# Altium schematic sheet 10. SOC SERDES0 IF.SchDoc: SERDES INTERFACE-1
size 513 x 386 mm; Project: PROC154E2(001)_SK_AM69; Issue: 1.0; RevCode: E3; Page Create Date: March  8, 1995; Variant Name: Core Design; Schematic Page Number: 10; Page Number: 10; Page Size: C; Comment: MISTRAL_TITLEBLK_CSIZE_1; Page Count: 62; Schematic Page Count: 62; Name: PROC154E2 001 SK AM69; DsnPath: C:\Users\danie\Downloads\sprr466c\PROC154E3_RP\PROC154E3_SCH.DSN; SchematicName: SCHEMATIC1; PageName: 10. SOC SERDES0 IF; PageSize: C; TopSchematic: True
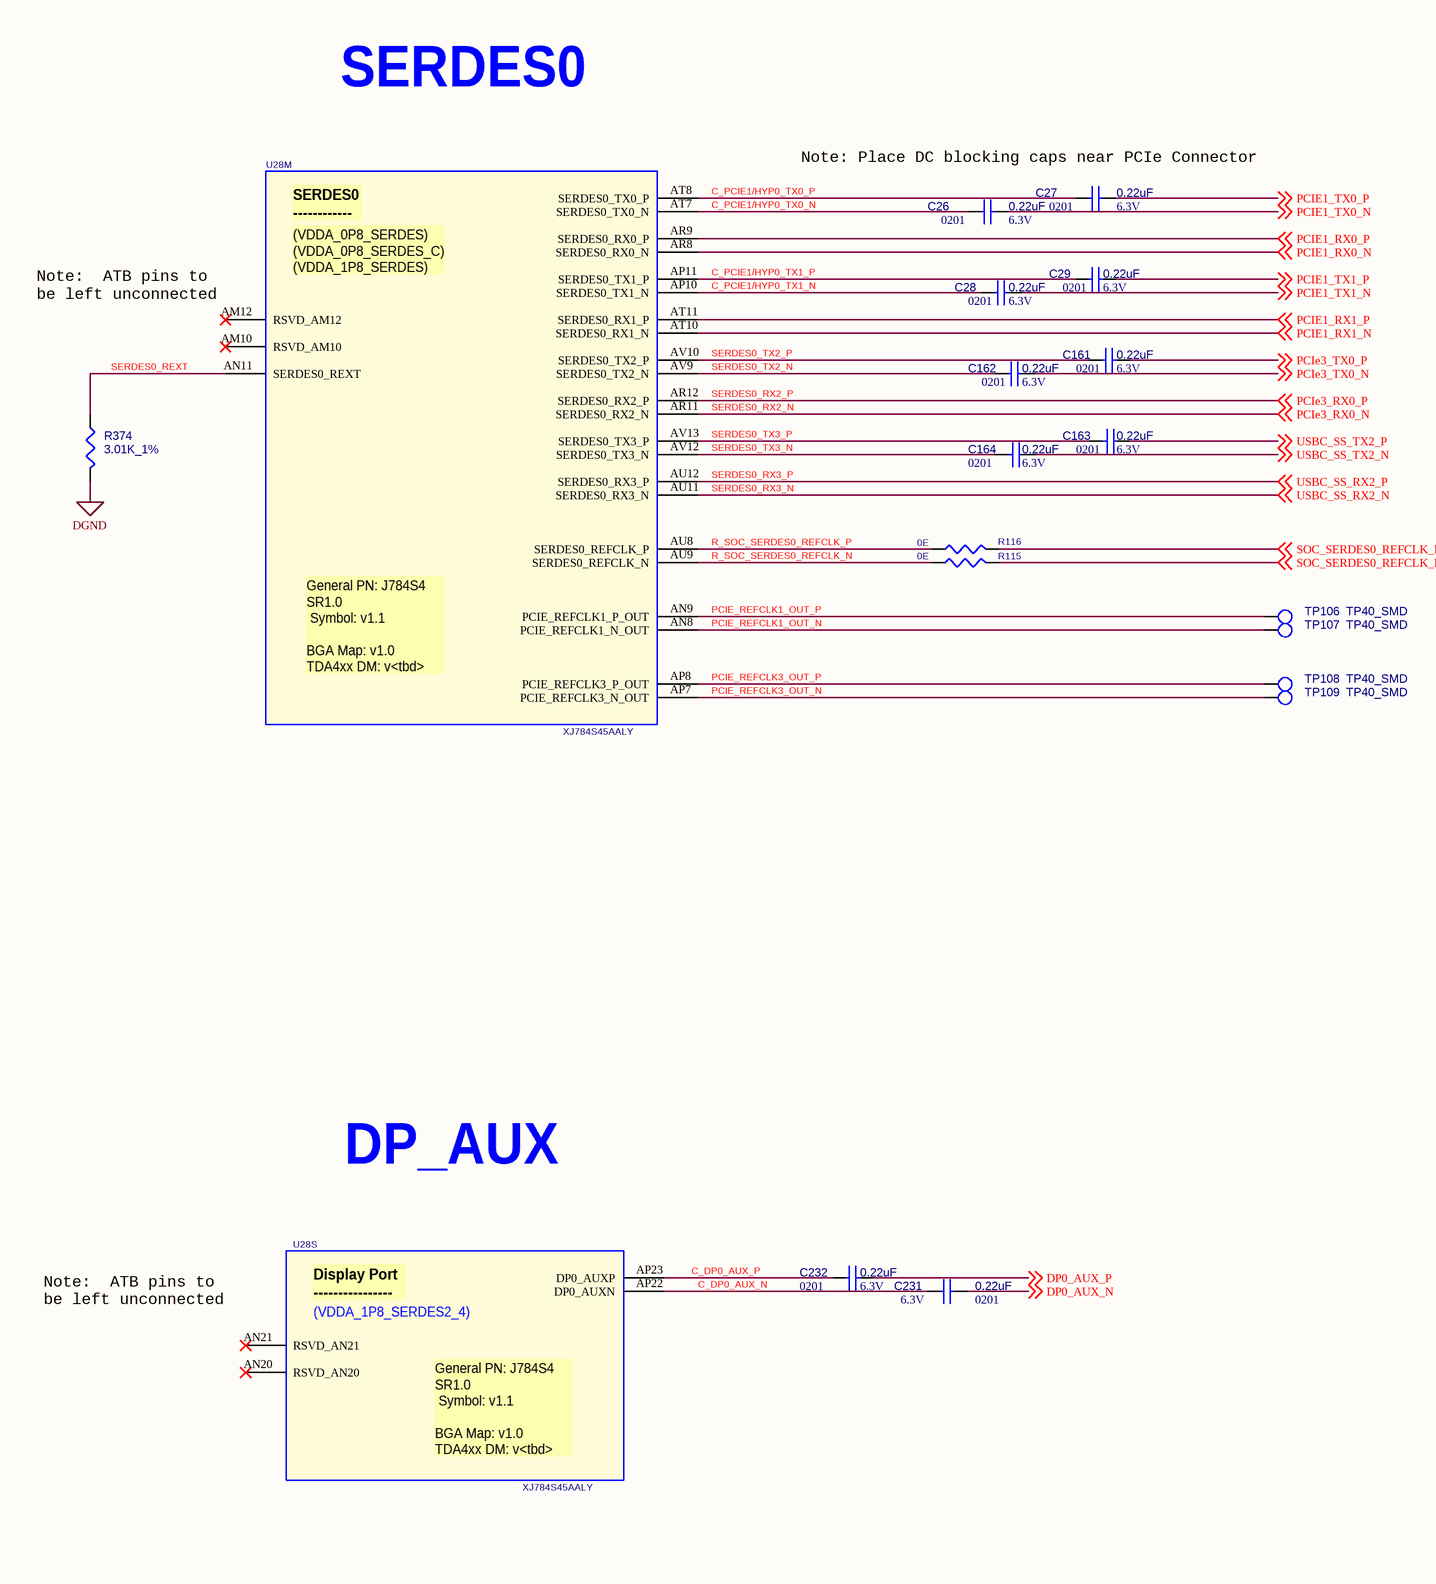
[diagram p0: 10. SOC SERDES0 IF.SchDoc, left]
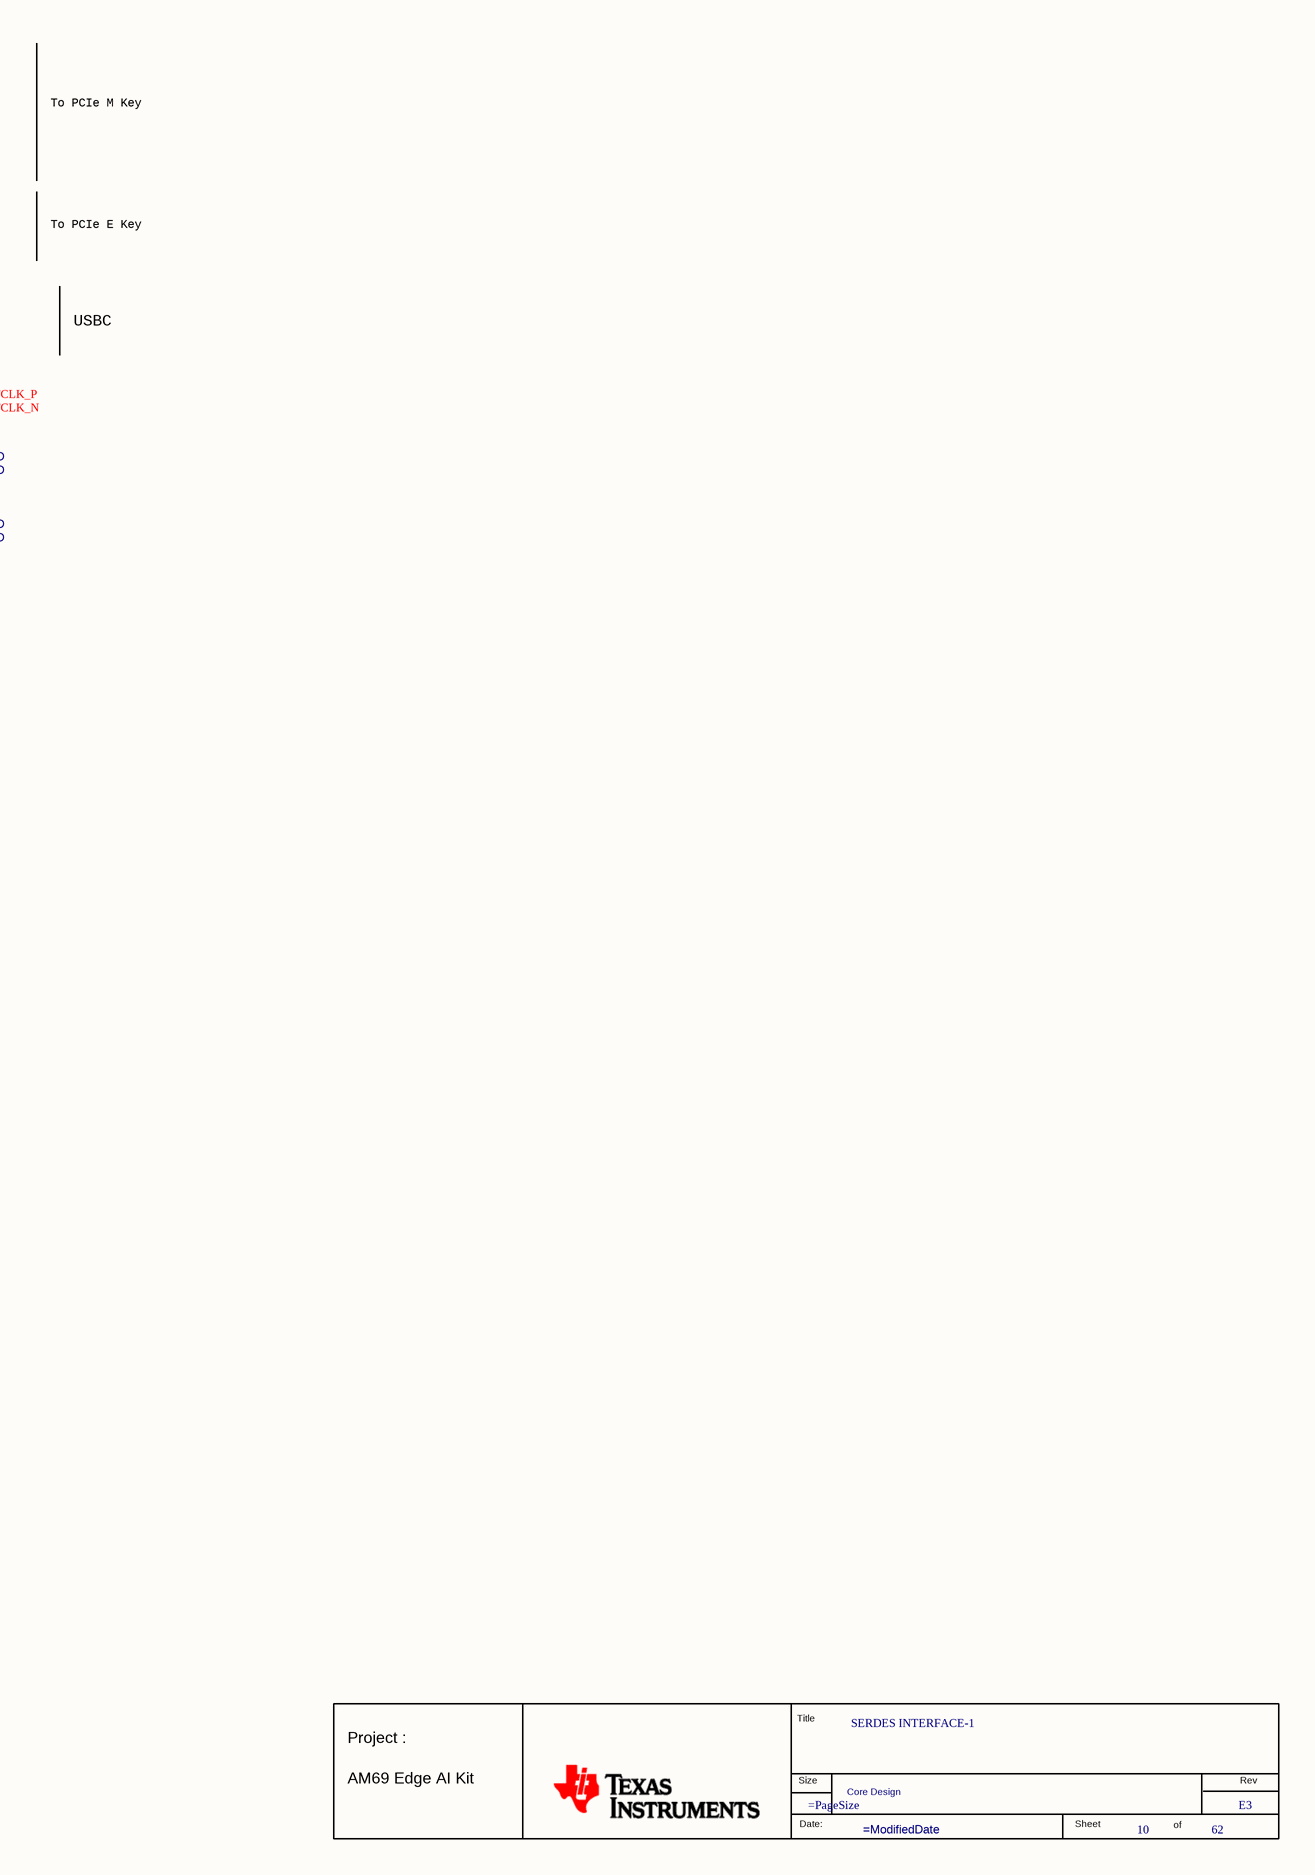
[diagram p1: 10. SOC SERDES0 IF.SchDoc, right]

## Parts
*  RevCode: E3  Title: SERDES INTERFACE-1  Page Number: 10  Page Count: 62  Variant Name: Core Design  (hidden comment: MISTRAL_TITLEBLK_CSIZE_1)  (graphical)
C26  0.22uF  Package: 0201  Voltage: 6.3V  [CAP0201_0-5]
C27  0.22uF  Voltage: 6.3V  Package: 0201  [CAP0201_0-5]
C28  0.22uF  Package: 0201  Voltage: 6.3V  [CAP0201_0-5]
C29  0.22uF  Package: 0201  Voltage: 6.3V  [CAP0201_0-5]
C161  0.22uF  Voltage: 6.3V  Package: 0201  [CAP0201_0-5]
C162  0.22uF  Voltage: 6.3V  Package: 0201  [CAP0201_0-5]
C163  0.22uF  Package: 0201  Voltage: 6.3V  [CAP0201_0-5]
C164  0.22uF  Voltage: 6.3V  Package: 0201  [CAP0201_0-5]
C231  0.22uF  Voltage: 6.3V  Package: 0201  [CAP0201_0-5]
C232  0.22uF  Package: 0201  Voltage: 6.3V  [CAP0201_0-5]
R115  0E  [RES0201_0-5]
R116  0E  [RES0201_0-5]
R374  3.01K_1%  [RES0201_0-5]
TP106  TP40_SMD  [TP40_SMD]
TP107  TP40_SMD  [TP40_SMD]
TP108  TP40_SMD  [TP40_SMD]
TP109  TP40_SMD  [TP40_SMD]
U28  XJ784S45AALY  [BGA1414_31-49_1230X1230_2-7]  (parts M,S of 26)

## Nets
DGND: R374.2
C_DP0_AUX_N: C231.1 U28.AP22(DP0_AUXN)
C_DP0_AUX_P: C232.1 U28.AP23(DP0_AUXP)
C_PCIE1/HYP0_TX0_N: C26.1 U28.AT7(SERDES0_TX0_N)
C_PCIE1/HYP0_TX0_P: C27.1 U28.AT8(SERDES0_TX0_P)
C_PCIE1/HYP0_TX1_N: C28.1 U28.AP10(SERDES0_TX1_N)
C_PCIE1/HYP0_TX1_P: C29.1 U28.AP11(SERDES0_TX1_P)
DP0_AUX_N: C231.2 ; off-sheet DP0_AUX_N
DP0_AUX_P: C232.2 ; off-sheet DP0_AUX_P
PCIE1_RX0_N: U28.AR8(SERDES0_RX0_N) ; off-sheet PCIE1_RX0_N
PCIE1_RX0_P: U28.AR9(SERDES0_RX0_P) ; off-sheet PCIE1_RX0_P
PCIE1_RX1_N: U28.AT10(SERDES0_RX1_N) ; off-sheet PCIE1_RX1_N
PCIE1_RX1_P: U28.AT11(SERDES0_RX1_P) ; off-sheet PCIE1_RX1_P
PCIE1_TX0_N: C26.2 ; off-sheet PCIE1_TX0_N
PCIE1_TX0_P: C27.2 ; off-sheet PCIE1_TX0_P
PCIE1_TX1_N: C28.2 ; off-sheet PCIE1_TX1_N
PCIE1_TX1_P: C29.2 ; off-sheet PCIE1_TX1_P
PCIe3_TX0_N: C162.2 ; off-sheet PCIe3_TX0_N
PCIe3_TX0_P: C161.2 ; off-sheet PCIe3_TX0_P
PCIE_REFCLK1_OUT_N: TP107.1(TP) U28.AN8(PCIE_REFCLK1_N_OUT)
PCIE_REFCLK1_OUT_P: TP106.1(TP) U28.AN9(PCIE_REFCLK1_P_OUT)
PCIE_REFCLK3_OUT_N: TP109.1(TP) U28.AP7(PCIE_REFCLK3_N_OUT)
PCIE_REFCLK3_OUT_P: TP108.1(TP) U28.AP8(PCIE_REFCLK3_P_OUT)
R_SOC_SERDES0_REFCLK_N: R115.2 U28.AU9(SERDES0_REFCLK_N)
R_SOC_SERDES0_REFCLK_P: R116.2 U28.AU8(SERDES0_REFCLK_P)
SERDES0_REXT: R374.1 U28.AN11(SERDES0_REXT)
SERDES0_RX2_N: U28.AR11(SERDES0_RX2_N) ; off-sheet PCIe3_RX0_N  [also labelled PCIe3_RX0_N]
SERDES0_RX2_P: U28.AR12(SERDES0_RX2_P) ; off-sheet PCIe3_RX0_P  [also labelled PCIe3_RX0_P]
SERDES0_RX3_N: U28.AU11(SERDES0_RX3_N) ; off-sheet USBC_SS_RX2_N  [also labelled USBC_SS_RX2_N]
SERDES0_RX3_P: U28.AU12(SERDES0_RX3_P) ; off-sheet USBC_SS_RX2_P  [also labelled USBC_SS_RX2_P]
SERDES0_TX2_N: C162.1 U28.AV9(SERDES0_TX2_N)
SERDES0_TX2_P: C161.1 U28.AV10(SERDES0_TX2_P)
SERDES0_TX3_N: C164.2 U28.AV12(SERDES0_TX3_N)
SERDES0_TX3_P: C163.2 U28.AV13(SERDES0_TX3_P)
SOC_SERDES0_REFCLK_N: R115.1 ; off-sheet SOC_SERDES0_REFCLK_N
SOC_SERDES0_REFCLK_P: R116.1 ; off-sheet SOC_SERDES0_REFCLK_P
USBC_SS_TX2_N: C164.1 ; off-sheet USBC_SS_TX2_N
USBC_SS_TX2_P: C163.1 ; off-sheet USBC_SS_TX2_P

Not connected (* = marked no-connect by the designer): U28 AM10(RSVD_AM10)* AM12(RSVD_AM12)* AN20(RSVD_AN20)* AN21(RSVD_AN21)*

## Notes on the sheet
- SERDES0
- Note: Place DC blocking caps near PCIe Connector
- (near U28) Note:  ATB pins to
  be left unconnected
- To PCIe M Key
- To PCIe E Key
- USBC
- DP_AUX
- (in symbol J7AHPSoC-EVM_BGA1414, part M) SERDES0 / ------------; (VDDA_0P8_SERDES) / (VDDA_0P8_SERDES_C) / (VDDA_1P8_SERDES); General PN: J784S4 / SR1.0 / Symbol: v1.1 / BGA Map: v1.0 / TDA4xx DM: v<tbd>
- (in symbol J7AHPSoC-EVM_BGA1414, part S) Display Port / ----------------; (VDDA_1P8_SERDES2_4); General PN: J784S4 / SR1.0 / Symbol: v1.1 / BGA Map: v1.0 / TDA4xx DM: v<tbd>
- (in symbol MISTRAL_TITLEBLK_CSIZE_1) Title; Project :; Size; Rev; AM69 Edge AI Kit; Date:; Sheet; of

## Library data of the parts
* = MISTRAL_TITLEBLK_CSIZE_1: Issue: 1.0; Project: PROC154E2(001)_SK_AM69; Name: PROC154E2 001 SK AM69; Page Create Date: March  8, 1995; Page Size: =PageSize; Page Modify Date: =ModifiedDate; Schematic Page Count: 62; Schematic Page Number: 10
C26 = CAP_Dup1: CAP CERAMIC 0.22uF 6.3V 10% X6S AUTO 0201; Part Reference: C26; Manufacturer: MURATA; Part_type: CAPACITORS\CERAMIC; Mfr_part_number: GRT033C80J224KE01D; Mistral Part No: 120019020011-R; Custom_Duty: 15%; Customs_HS_Code: 85322990; Wattage: NA; Project: TI_J7ES_EVM_SOM; SIGNAL_MODEL: CAP_CAP0201_0-5_0.22UF_0.22uF; Value: 0.22uF; Chkd/date: MANIRAJA/220219; Crtd /date: ALVY/220219; Datasheet: Y:\MIS_DATABASE\DATASHEETS\CAPACITORS\MURATA-GCM-SER.PDF; Temperature: -55°C+105°C; Weight: 0.17mg; Height: 0.33MM; Library Ref: CAP; Distributor_part_number: 490-12230-1-ND; Distributor_name: DIGIKEY; Tolerance: 10%; Mfr_name: MURATA; MECHANICAL 3D STEP FILE: CAP0201_0-5; Footprint Ref: CAP0201_0-5; Library Path: Y:\MIS_DATABASE\Library\ALTIUM_TOOL\SCHEMATICS_PARTS\MS_DISCRETE_Library.schlib; Footprint Path: Y:\MIS_DATABASE\Library\ALTIUM_TOOL\PCB_FOOTPRINTS\Altium_Footprint_Lib.PcbLib; PCB Footprint: CAP0201_0-5
C27 = CAP_Dup1: CAP CERAMIC 0.22uF 6.3V 10% X6S AUTO 0201; Part Reference: C27; Manufacturer: MURATA; Mistral Part No: 120019020011-R; Mfr_part_number: GRT033C80J224KE01D; Part_type: CAPACITORS\CERAMIC; Project: TI_J7ES_EVM_SOM; Wattage: NA; Customs_HS_Code: 85322990; Custom_Duty: 15%; SIGNAL_MODEL: CAP_CAP0201_0-5_0.22UF_0.22uF; Value: 0.22uF; MECHANICAL 3D STEP FILE: CAP0201_0-5; Mfr_name: MURATA; Tolerance: 10%; Distributor_name: DIGIKEY; Distributor_part_number: 490-12230-1-ND; Library Ref: CAP; Height: 0.33MM; Weight: 0.17mg; Temperature: -55°C+105°C; Datasheet: Y:\MIS_DATABASE\DATASHEETS\CAPACITORS\MURATA-GCM-SER.PDF; Crtd /date: ALVY/220219; Chkd/date: MANIRAJA/220219; Footprint Ref: CAP0201_0-5; Library Path: Y:\MIS_DATABASE\Library\ALTIUM_TOOL\SCHEMATICS_PARTS\MS_DISCRETE_Library.schlib; Footprint Path: Y:\MIS_DATABASE\Library\ALTIUM_TOOL\PCB_FOOTPRINTS\Altium_Footprint_Lib.PcbLib; PCB Footprint: CAP0201_0-5
C28 = CAP_Dup1: CAP CERAMIC 0.22uF 6.3V 10% X6S AUTO 0201; Part Reference: C28; Manufacturer: MURATA; Part_type: CAPACITORS\CERAMIC; Mfr_part_number: GRT033C80J224KE01D; Mistral Part No: 120019020011-R; Custom_Duty: 15%; Customs_HS_Code: 85322990; Wattage: NA; Project: TI_J7ES_EVM_SOM; SIGNAL_MODEL: CAP_CAP0201_0-5_0.22UF_0.22uF; Value: 0.22uF; Chkd/date: MANIRAJA/220219; Crtd /date: ALVY/220219; Datasheet: Y:\MIS_DATABASE\DATASHEETS\CAPACITORS\MURATA-GCM-SER.PDF; Temperature: -55°C+105°C; Weight: 0.17mg; Height: 0.33MM; Library Ref: CAP; Distributor_part_number: 490-12230-1-ND; Distributor_name: DIGIKEY; Tolerance: 10%; Mfr_name: MURATA; MECHANICAL 3D STEP FILE: CAP0201_0-5; Footprint Ref: CAP0201_0-5; Library Path: Y:\MIS_DATABASE\Library\ALTIUM_TOOL\SCHEMATICS_PARTS\MS_DISCRETE_Library.schlib; Footprint Path: Y:\MIS_DATABASE\Library\ALTIUM_TOOL\PCB_FOOTPRINTS\Altium_Footprint_Lib.PcbLib; PCB Footprint: CAP0201_0-5
C29 = CAP_Dup1: CAP CERAMIC 0.22uF 6.3V 10% X6S AUTO 0201; Part Reference: C29; Manufacturer: MURATA; Part_type: CAPACITORS\CERAMIC; Mfr_part_number: GRT033C80J224KE01D; Mistral Part No: 120019020011-R; Custom_Duty: 15%; Customs_HS_Code: 85322990; Wattage: NA; Project: TI_J7ES_EVM_SOM; SIGNAL_MODEL: CAP_CAP0201_0-5_0.22UF_0.22uF; Value: 0.22uF; Footprint Path: Y:\MIS_DATABASE\Library\ALTIUM_TOOL\PCB_FOOTPRINTS\Altium_Footprint_Lib.PcbLib; Library Path: Y:\MIS_DATABASE\Library\ALTIUM_TOOL\SCHEMATICS_PARTS\MS_DISCRETE_Library.schlib; Footprint Ref: CAP0201_0-5; Chkd/date: MANIRAJA/220219; Crtd /date: ALVY/220219; Datasheet: Y:\MIS_DATABASE\DATASHEETS\CAPACITORS\MURATA-GCM-SER.PDF; Temperature: -55°C+105°C; Weight: 0.17mg; Height: 0.33MM; Library Ref: CAP; Distributor_part_number: 490-12230-1-ND; Distributor_name: DIGIKEY; Tolerance: 10%; Mfr_name: MURATA; MECHANICAL 3D STEP FILE: CAP0201_0-5; PCB Footprint: CAP0201_0-5
C161 = CAP_Dup1: CAP CERAMIC 0.22uF 6.3V 10% X6S AUTO 0201; Part Reference: C161; Manufacturer: MURATA; Mistral Part No: 120019020011-R; Mfr_part_number: GRT033C80J224KE01D; Part_type: CAPACITORS\CERAMIC; Project: TI_J7ES_EVM_SOM; Wattage: NA; Customs_HS_Code: 85322990; Custom_Duty: 15%; Value: 0.22uF; Footprint Path: Y:\MIS_DATABASE\Library\ALTIUM_TOOL\PCB_FOOTPRINTS\Altium_Footprint_Lib.PcbLib; Library Path: Y:\MIS_DATABASE\Library\ALTIUM_TOOL\SCHEMATICS_PARTS\MS_DISCRETE_Library.schlib; Footprint Ref: CAP0201_0-5; MECHANICAL 3D STEP FILE: CAP0201_0-5; Mfr_name: MURATA; Tolerance: 10%; Distributor_name: DIGIKEY; Distributor_part_number: 490-12230-1-ND; Library Ref: CAP; Height: 0.33MM; Weight: 0.17mg; Temperature: -55°C+105°C; Datasheet: Y:\MIS_DATABASE\DATASHEETS\CAPACITORS\MURATA-GCM-SER.PDF; Crtd /date: ALVY/220219; Chkd/date: MANIRAJA/220219; PCB Footprint: CAP0201_0-5
C162 = CAP_Dup1: CAP CERAMIC 0.22uF 6.3V 10% X6S AUTO 0201; Part Reference: C162; Manufacturer: MURATA; Mistral Part No: 120019020011-R; Mfr_part_number: GRT033C80J224KE01D; Part_type: CAPACITORS\CERAMIC; Project: TI_J7ES_EVM_SOM; Wattage: NA; Customs_HS_Code: 85322990; Custom_Duty: 15%; Value: 0.22uF; Footprint Path: Y:\MIS_DATABASE\Library\ALTIUM_TOOL\PCB_FOOTPRINTS\Altium_Footprint_Lib.PcbLib; Library Path: Y:\MIS_DATABASE\Library\ALTIUM_TOOL\SCHEMATICS_PARTS\MS_DISCRETE_Library.schlib; Footprint Ref: CAP0201_0-5; MECHANICAL 3D STEP FILE: CAP0201_0-5; Mfr_name: MURATA; Tolerance: 10%; Distributor_name: DIGIKEY; Distributor_part_number: 490-12230-1-ND; Library Ref: CAP; Height: 0.33MM; Weight: 0.17mg; Temperature: -55°C+105°C; Datasheet: Y:\MIS_DATABASE\DATASHEETS\CAPACITORS\MURATA-GCM-SER.PDF; Crtd /date: ALVY/220219; Chkd/date: MANIRAJA/220219; PCB Footprint: CAP0201_0-5
C163 = CAP_Dup1: CAP CERAMIC 0.22uF 6.3V 10% X6S AUTO 0201; Part Reference: C163; Part_type: CAPACITORS\CERAMIC; Mfr_part_number: GRT033C80J224KE01D; Mfr_name: MURATA; Mistral Part No: 120019020011-R; Custom_Duty: 15%; Customs_HS_Code: 85322990; Wattage: NA; Project: TI_J7ES_EVM_SOM; Value: 0.22uF; Chkd/date: MANIRAJA/220219; Crtd /date: ALVY/220219; Datasheet: Y:\MIS_DATABASE\DATASHEETS\CAPACITORS\MURATA-GCM-SER.PDF; Temperature: -55°C+105°C; Weight: 0.17mg; Height: 0.33MM; Library Ref: CAP; Distributor_part_number: 490-12230-1-ND; Distributor_name: DIGIKEY; Tolerance: 10%; MECHANICAL 3D STEP FILE: CAP0201_0-5; Footprint Ref: CAP0201_0-5; Library Path: Y:\MIS_DATABASE\Library\ALTIUM_TOOL\SCHEMATICS_PARTS\MS_DISCRETE_Library.schlib; Footprint Path: Y:\MIS_DATABASE\Library\ALTIUM_TOOL\PCB_FOOTPRINTS\Altium_Footprint_Lib.PcbLib; Manufacturer: MURATA; PCB Footprint: CAP0201_0-5
C164 = CAP_Dup1: CAP CERAMIC 0.22uF 6.3V 10% X6S AUTO 0201; Part Reference: C164; Mistral Part No: 120019020011-R; Mfr_name: MURATA; Mfr_part_number: GRT033C80J224KE01D; Part_type: CAPACITORS\CERAMIC; Project: TI_J7ES_EVM_SOM; Wattage: NA; Customs_HS_Code: 85322990; Custom_Duty: 15%; Value: 0.22uF; Footprint Path: Y:\MIS_DATABASE\Library\ALTIUM_TOOL\PCB_FOOTPRINTS\Altium_Footprint_Lib.PcbLib; Library Path: Y:\MIS_DATABASE\Library\ALTIUM_TOOL\SCHEMATICS_PARTS\MS_DISCRETE_Library.schlib; Footprint Ref: CAP0201_0-5; MECHANICAL 3D STEP FILE: CAP0201_0-5; Tolerance: 10%; Distributor_name: DIGIKEY; Distributor_part_number: 490-12230-1-ND; Library Ref: CAP; Height: 0.33MM; Weight: 0.17mg; Temperature: -55°C+105°C; Datasheet: Y:\MIS_DATABASE\DATASHEETS\CAPACITORS\MURATA-GCM-SER.PDF; Crtd /date: ALVY/220219; Chkd/date: MANIRAJA/220219; Manufacturer: MURATA; PCB Footprint: CAP0201_0-5
C231 = CAP_Dup1: CAP CERAMIC 0.22uF 6.3V 10% X6S AUTO 0201; Part Reference: C231; Mistral Part No: 120019020011-R; Mfr_name: MURATA; Mfr_part_number: GRT033C80J224KE01D; Part_type: CAPACITORS\CERAMIC; Project: TI_J7ES_EVM_SOM; Wattage: NA; Customs_HS_Code: 85322990; Custom_Duty: 15%; SIGNAL_MODEL: CAP_CAP0201_0-5_0.22UF_0.22uF; Value: 0.22uF; PCB Footprint: CAP0201_0-5; Footprint Ref: CAP0201_0-5; Tolerance: 10%; Distributor_name: DIGIKEY; Distributor_part_number: 490-12230-1-ND; Library Ref: CAP; Height: 0.33MM; Weight: 0.17mg; Temperature: -55°C+105°C; Datasheet: Y:\MIS_DATABASE\DATASHEETS\CAPACITORS\MURATA-GCM-SER.PDF; Crtd /date: ALVY/220219; Chkd/date: MANIRAJA/220219; MECHANICAL 3D STEP FILE: CAP0201_0-5; Library Path: Y:\MIS_DATABASE\Library\ALTIUM_TOOL\SCHEMATICS_PARTS\MS_DISCRETE_Library.schlib; Footprint Path: Y:\MIS_DATABASE\Library\ALTIUM_TOOL\PCB_FOOTPRINTS\Altium_Footprint_Lib.PcbLib; Manufacturer: MURATA
C232 = CAP_Dup1: CAP CERAMIC 0.22uF 6.3V 10% X6S AUTO 0201; Part Reference: C232; Part_type: CAPACITORS\CERAMIC; Mfr_part_number: GRT033C80J224KE01D; Mfr_name: MURATA; Mistral Part No: 120019020011-R; Custom_Duty: 15%; Customs_HS_Code: 85322990; Wattage: NA; Project: TI_J7ES_EVM_SOM; SIGNAL_MODEL: CAP_CAP0201_0-5_0.22UF_0.22uF; Value: 0.22uF; PCB Footprint: CAP0201_0-5; Footprint Path: Y:\MIS_DATABASE\Library\ALTIUM_TOOL\PCB_FOOTPRINTS\Altium_Footprint_Lib.PcbLib; Library Path: Y:\MIS_DATABASE\Library\ALTIUM_TOOL\SCHEMATICS_PARTS\MS_DISCRETE_Library.schlib; MECHANICAL 3D STEP FILE: CAP0201_0-5; Chkd/date: MANIRAJA/220219; Crtd /date: ALVY/220219; Datasheet: Y:\MIS_DATABASE\DATASHEETS\CAPACITORS\MURATA-GCM-SER.PDF; Temperature: -55°C+105°C; Weight: 0.17mg; Height: 0.33MM; Library Ref: CAP; Distributor_part_number: 490-12230-1-ND; Distributor_name: DIGIKEY; Tolerance: 10%; Footprint Ref: CAP0201_0-5; Manufacturer: MURATA
R115 = RESISTOR: RES 0E 1/20W 5% 0201; Part Reference: R115; Manufacturer: YAGEO AMERICA; Mistral Part No: 110010070067-R; Mfr_part_number: RC0201JR-070RL; Part_type: RESISTORS\FIXED; Project: PB_BUGBASE; Voltage: NA; Customs_HS_Code: 85332119; Custom_Duty: 15%; Value: 0E; Footprint Ref: RES0201_0-5; Mfr_name: YAGEO AMERICA; Tolerance: 5%; Wattage: 1/20W; Package: 0201; Distributor_name: DIGIKEY; Distributor_part_number: 311-0.0NCT-ND; Library Ref: RESISTOR; Height: 0.26MM; Weight: 0.17mg; Temperature: -55°C+125°C; Datasheet: Y:\MIS_DATABASE\DATASHEETS\RESISTORS\RCXXXXL-SER_MAR18.PDF; Crtd /date: MUDDU/120710; Chkd/date: NAVEED/301214; MECHANICAL 3D STEP FILE: RES0201_0-5; Library Path: Y:\MIS_DATABASE\Library\ALTIUM_TOOL\SCHEMATICS_PARTS\MS_DISCRETE_Library.schlib; Footprint Path: Y:\MIS_DATABASE\Library\ALTIUM_TOOL\PCB_FOOTPRINTS\Altium_Footprint_Lib.PcbLib; PCB Footprint: RES0201_0-5
R116 = RESISTOR: RES 0E 1/20W 5% 0201; Part Reference: R116; Manufacturer: YAGEO AMERICA; Part_type: RESISTORS\FIXED; Mfr_part_number: RC0201JR-070RL; Mistral Part No: 110010070067-R; Custom_Duty: 15%; Customs_HS_Code: 85332119; Voltage: NA; Project: PB_BUGBASE; Value: 0E; Footprint Path: Y:\MIS_DATABASE\Library\ALTIUM_TOOL\PCB_FOOTPRINTS\Altium_Footprint_Lib.PcbLib; Library Path: Y:\MIS_DATABASE\Library\ALTIUM_TOOL\SCHEMATICS_PARTS\MS_DISCRETE_Library.schlib; MECHANICAL 3D STEP FILE: RES0201_0-5; Chkd/date: NAVEED/301214; Crtd /date: MUDDU/120710; Datasheet: Y:\MIS_DATABASE\DATASHEETS\RESISTORS\RCXXXXL-SER_MAR18.PDF; Temperature: -55°C+125°C; Weight: 0.17mg; Height: 0.26MM; Library Ref: RESISTOR; Distributor_part_number: 311-0.0NCT-ND; Distributor_name: DIGIKEY; Package: 0201; Wattage: 1/20W; Tolerance: 5%; Mfr_name: YAGEO AMERICA; Footprint Ref: RES0201_0-5; PCB Footprint: RES0201_0-5
R374 = RESISTOR_Dup2: RES 3.01K 1/20W 1% 0201; Part Reference: R374; Manufacturer: PANASONIC-ECG; Part_type: RESISTORS\FIXED; Mfr_part_number: ERJ-1GNF3011C; Mistral Part No: 110015080044-R; Custom_Duty: 15%; Customs_HS_Code: 85332119; Voltage: NA; Project: J7ES_SOM_DUAL-LEO_PMIC; Value: 3.01K_1%; PCB Footprint: RES0201_0-5; Chkd/date: MANIRAJA/160519; Crtd /date: ALVY/160519; Datasheet: Y:\MIS_DATABASE\DATASHEETS\RESISTORS\PAN-ERJSER_NOV17.PDF; Temperature: -55°C+125°C; Weight: 0.15mg; Height: 0.26MM; Library Ref: RESISTOR; Distributor_part_number: P122916CT-ND; Distributor_name: DIGIKEY; Package: 0201; Wattage: 1/20W; Tolerance: 1%; Mfr_name: PANASONIC-ECG; Footprint Ref: RES0201_0-5; MECHANICAL 3D STEP FILE: RES0201_0-5; Library Path: Y:\MIS_DATABASE\Library\ALTIUM_TOOL\SCHEMATICS_PARTS\MS_DISCRETE_Library.schlib; Footprint Path: Y:\MIS_DATABASE\Library\ALTIUM_TOOL\PCB_FOOTPRINTS\Altium_Footprint_Lib.PcbLib
TP106 = TESTPOINT_Dup1: TESTPOINT CIR 40 SMD; Part Reference: TP106; Mfr_name: LOCAL; Mistral Part No: 130009030933; MECHANICAL 3D STEP FILE: NA; Project: RAINIER-3; Value: TP40_SMD; PCB Footprint: TP40_SMD; Footprint Ref: TP40_SMD; Library Ref: TESTPOINT; Footprint Path: Y:\MIS_DATABASE\Library\ALTIUM_TOOL\PCB_FOOTPRINTS\Altium_Footprint_Lib.PcbLib; Library Path: Y:\MIS_DATABASE\Library\ALTIUM_TOOL\SCHEMATICS_PARTS\MS_DISCRETE_Library.schlib; Chkd/date: MAZHAR/190505; Crtd /date: MAZHAR/190505; Datasheet: NA; Temperature: NA; Weight: NA; Height: NA; Distributor_part_number: NA; Distributor_name: NA; Package: SMD; Wattage: NA; Voltage: NA; Tolerance: NA; Part_type: TESTPOINT; Mfr_part_number: TP40_SMD; RoHS: NA; Manufacturer: LOCAL
TP107 = TESTPOINT_Dup1: TESTPOINT CIR 40 SMD; Part Reference: TP107; Mfr_name: LOCAL; Mistral Part No: 130009030933; MECHANICAL 3D STEP FILE: NA; Project: RAINIER-3; Value: TP40_SMD; PCB Footprint: TP40_SMD; Footprint Ref: TP40_SMD; Library Ref: TESTPOINT; Footprint Path: Y:\MIS_DATABASE\Library\ALTIUM_TOOL\PCB_FOOTPRINTS\Altium_Footprint_Lib.PcbLib; Library Path: Y:\MIS_DATABASE\Library\ALTIUM_TOOL\SCHEMATICS_PARTS\MS_DISCRETE_Library.schlib; Chkd/date: MAZHAR/190505; Crtd /date: MAZHAR/190505; Datasheet: NA; Temperature: NA; Weight: NA; Height: NA; Distributor_part_number: NA; Distributor_name: NA; Package: SMD; Wattage: NA; Voltage: NA; Tolerance: NA; Part_type: TESTPOINT; Mfr_part_number: TP40_SMD; RoHS: NA; Manufacturer: LOCAL
TP108 = TESTPOINT_Dup1: TESTPOINT CIR 40 SMD; Part Reference: TP108; Mfr_name: LOCAL; Mistral Part No: 130009030933; MECHANICAL 3D STEP FILE: NA; Project: RAINIER-3; Value: TP40_SMD; PCB Footprint: TP40_SMD; Footprint Ref: TP40_SMD; Library Ref: TESTPOINT; Footprint Path: Y:\MIS_DATABASE\Library\ALTIUM_TOOL\PCB_FOOTPRINTS\Altium_Footprint_Lib.PcbLib; Library Path: Y:\MIS_DATABASE\Library\ALTIUM_TOOL\SCHEMATICS_PARTS\MS_DISCRETE_Library.schlib; Chkd/date: MAZHAR/190505; Crtd /date: MAZHAR/190505; Datasheet: NA; Temperature: NA; Weight: NA; Height: NA; Distributor_part_number: NA; Distributor_name: NA; Package: SMD; Wattage: NA; Voltage: NA; Tolerance: NA; Part_type: TESTPOINT; Mfr_part_number: TP40_SMD; RoHS: NA; Manufacturer: LOCAL
TP109 = TESTPOINT_Dup1: TESTPOINT CIR 40 SMD; Part Reference: TP109; Mfr_name: LOCAL; Mistral Part No: 130009030933; MECHANICAL 3D STEP FILE: NA; Project: RAINIER-3; Value: TP40_SMD; PCB Footprint: TP40_SMD; Footprint Ref: TP40_SMD; Library Ref: TESTPOINT; Footprint Path: Y:\MIS_DATABASE\Library\ALTIUM_TOOL\PCB_FOOTPRINTS\Altium_Footprint_Lib.PcbLib; Library Path: Y:\MIS_DATABASE\Library\ALTIUM_TOOL\SCHEMATICS_PARTS\MS_DISCRETE_Library.schlib; Chkd/date: MAZHAR/190505; Crtd /date: MAZHAR/190505; Datasheet: NA; Temperature: NA; Weight: NA; Height: NA; Distributor_part_number: NA; Distributor_name: NA; Package: SMD; Wattage: NA; Voltage: NA; Tolerance: NA; Part_type: TESTPOINT; Mfr_part_number: TP40_SMD; RoHS: NA; Manufacturer: LOCAL
U28 = J7AHPSoC-EVM_BGA1414: IC AM69 SoC EVM MICROPROCESSOR BGA1414; Part Reference: U28; Part_type: ICS\DIGITAL\MICROPROCESSOR; Mfr_name: TEXAS INSTRUMENTS; Mistral Part No: 141230020002; SPLIT_INST: TRUE; SWAP_INFO: (S1+S2+S3+S4+S5+S6+S7+S8+S9+S10+S11+S12+S13+S14+S15+S16+S17+S18+S19+S20+S21+S22+S23+S24+S25+S26); Custom_Duty: 15%; Customs_HS_Code: 85423100; Wattage: NA; Project: TI_J7AHP SK_BRD; Value: XJ784S45AALY; PCB Footprint: BGA1414_31-49_1230X1230_2-7; Footprint Path: Y:\MIS_DATABASE\Library\ALTIUM_TOOL\PCB_FOOTPRINTS\Altium_Footprint_Lib.PcbLib; Library Path: Y:\MIS_DATABASE\Library\ALTIUM_TOOL\SCHEMATICS_PARTS\MS_MICROPROCESSOR_Library.schlib; MECHANICAL 3D STEP FILE: BGA1414_31-49_1230X1230_2-7; RoHS: NA; Chkd/date: MANIRAJA/151221; Crtd /date: ALVY/141221; Datasheet: Y:\MIS_DATABASE\DATASHEETS\ICS\DIGITAL\MICROCONTROLLER\J7AHP-SoC-EVM.PDF; Temperature: NA; Weight: NA; Height: 2.70MM; Library Ref: J7AHPSoC-EVM_BGA1414; Distributor_part_number: NA; Distributor_name: NA; Package: BGA1414; Voltage: NA; Tolerance: NA; Mfr_part_number: XJ784S45AALY; Footprint Ref: BGA1414_31-49_1230X1230_2-7; Manufacturer: TEXAS INSTRUMENTS